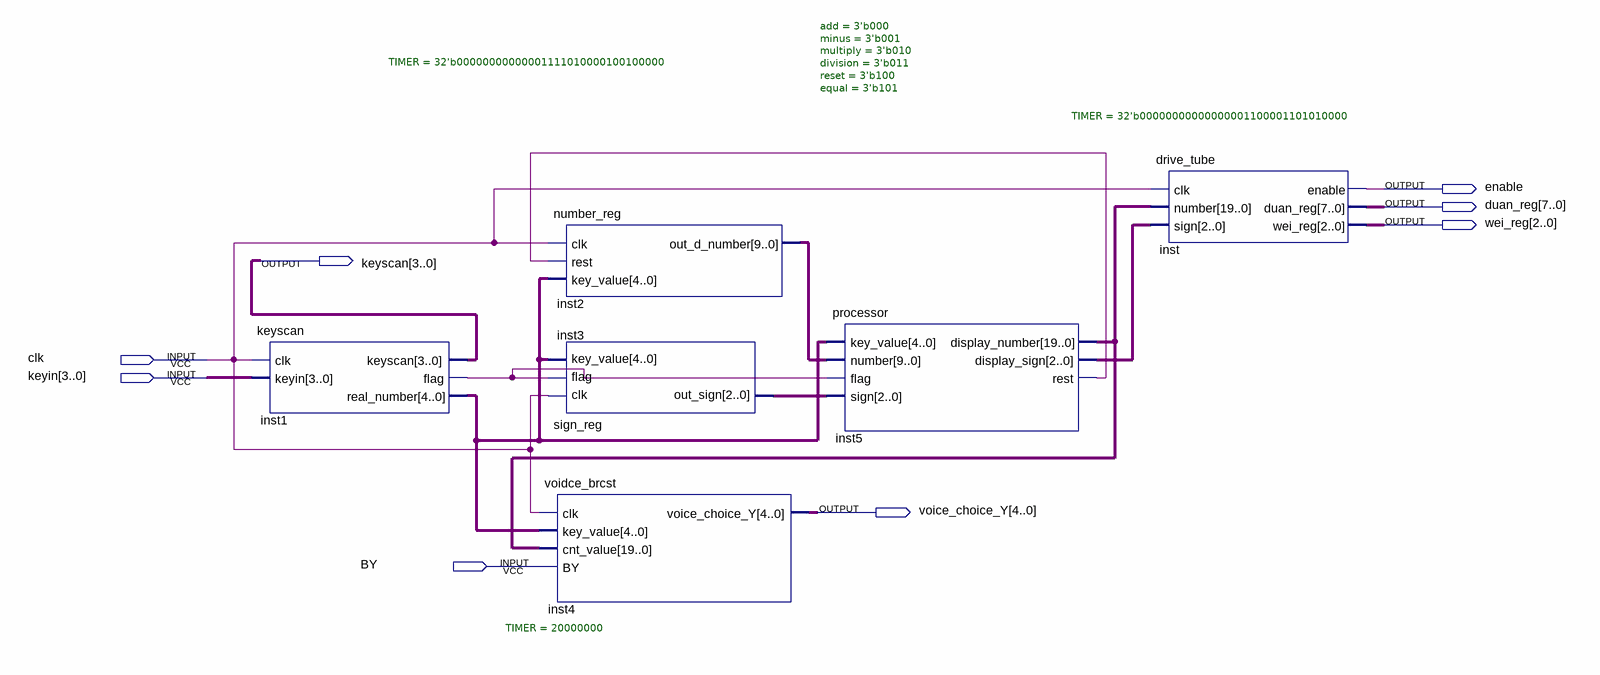
[diagram p0: schematic sheet]
// Quartus schematic Counter.bdf as structural Verilog: 6 symbols, 8 pins
module Counter (
  input  clk,
  input  [3:0] keyin,
  input  BY,
  output enable,
  output [7:0] duan_reg,
  output [2:0] wei_reg,
  output [3:0] keyscan,
  output [4:0] voice_choice_Y
);

  wire inst1_flag, inst5_rest;
  wire [2:0] inst3_out_sign, inst5_display_sign;
  wire [4:0] inst1_real_number;
  wire [9:0] inst2_out_d_number;
  wire [19:0] inst5_display_number;

  keyscan #(.TIMER(32'b00000000000001111010000100100000)) inst1 (
    .clk(clk), .keyin(keyin), .keyscan(keyscan), .flag(inst1_flag), .real_number(inst1_real_number));
  number_reg inst2 (.clk(clk), .rest(inst5_rest), .key_value(inst1_real_number), .out_d_number(inst2_out_d_number));
  sign_reg #(.add(3'b000), .minus(3'b001), .multiply(3'b010), .division(3'b011), .reset(3'b100), .equal(3'b101)) inst3 (
    .clk(clk), .flag(inst1_flag), .key_value(inst1_real_number), .out_sign(inst3_out_sign));
  voidce_brcst #(.TIMER(20000000)) inst4 (
    .clk(clk), .key_value(inst1_real_number), .cnt_value(inst5_display_number), .BY(BY),
    .voice_choice_Y(voice_choice_Y));
  processor inst5 (
    .key_value(inst1_real_number), .number(inst2_out_d_number), .flag(inst1_flag), .sign(inst3_out_sign),
    .display_number(inst5_display_number), .display_sign(inst5_display_sign), .rest(inst5_rest));
  drive_tube #(.TIMER(32'b00000000000000001100001101010000)) inst (
    .clk(clk), .number(inst5_display_number), .sign(inst5_display_sign), .enable(enable),
    .duan_reg(duan_reg), .wei_reg(wei_reg));
endmodule
